# Altium schematic sheet ToF_Bottom.SchDoc
size A4; SheetNumber: 2; SheetTotal: 10
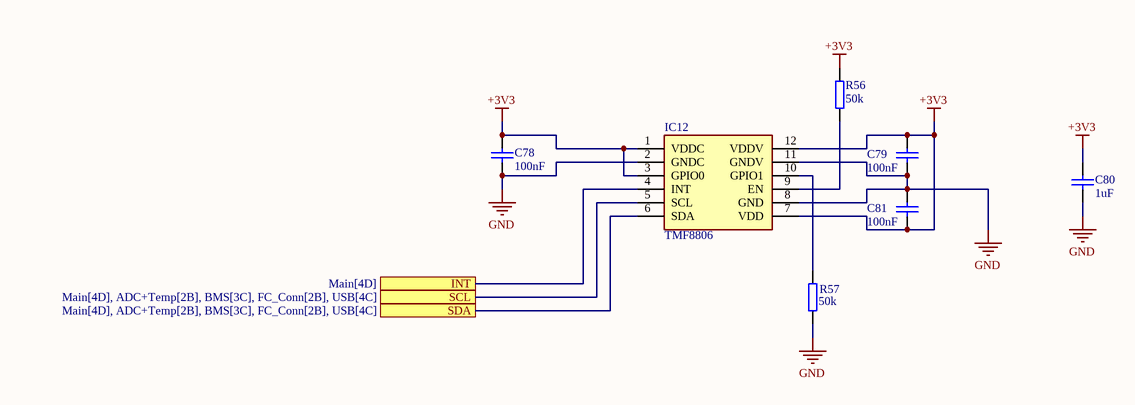
[diagram p0: ToF_Bottom.SchDoc]

## Parts
C78  value 100nF  [CAP0402]  (hidden comment: Cap0402)
C79  value 100nF  [CAP0402]  (hidden comment: Cap0402)
C80  value 1uF  [CAP0603]  (hidden comment: Cap0603)
C81  value 100nF  [CAP0402]  (hidden comment: Cap0402)
IC12  TMF8806  [TMF88051B]
R56  value 50k  [RES0402]  (hidden comment: Res0402)
R57  value 50k  [RES0402]  (hidden comment: Res0402)

## Ports
INT (see Main[4D]), SCL (see Main[4D], ADC+Temp[2B], BMS[3C], FC_Conn[2B], USB[4C]), SDA (see Main[4D], ADC+Temp[2B], BMS[3C], FC_Conn[2B], USB[4C])

## Nets
+3V3: C78.2 C79.2 C80.2 C81.1 IC12.1(VDDC) IC12.3(GPIO0) IC12.7(VDD) IC12.12(VDDV) R56.2
GND: C78.1 C79.1 C80.1 C81.2 IC12.2(GNDC) IC12.8(GND) IC12.11(GNDV) R57.1
INT: IC12.4(INT) ; port INT
SCL: IC12.5(SCL) ; port SCL
SDA: IC12.6(SDA) ; port SDA
NetIC12_9: IC12.9(EN) R56.1
NetIC12_10: IC12.10(GPIO1) R57.2

## Library data of the parts
C78 C79 C81 = Cap0402: Voltage: 6V3
C80 = Cap0603: Voltage: 25V
IC12 = TMF8805-1B: Integrated Circuit; Manufacturer_Name: ams OSRAM; Datasheet Link: https://ams.com/documents/20143/4372629/TMF8805_DS000692_4-00.pdf; Height: 1.1mm; Manufacturer_Part_Number: TMF8805-1B; Mouser Part Number: 985-TMF8805-1B; Mouser Price/Stock: https://www.mouser.co.uk/ProductDetail/ams-OSRAM/TMF8805-1B?qs=sPbYRqrBIVlwsjHE%2F%252BrL9g%3D%3D